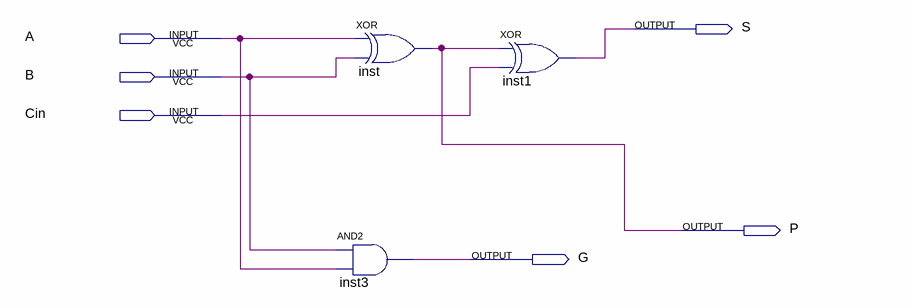
[diagram p0: schematic sheet]
// Quartus schematic onebitadder.bdf as structural Verilog: 3 symbols, 6 pins
module onebitadder (
  input  A,
  input  B,
  input  Cin,
  output S,
  output P,
  output G
);

  xor inst (P, A, B);
  and inst3 (G, B, A);
  xor inst1 (S, P, Cin);
endmodule
